# EAGLE design rcz80test_v1 (EAGLE 9.6.2)
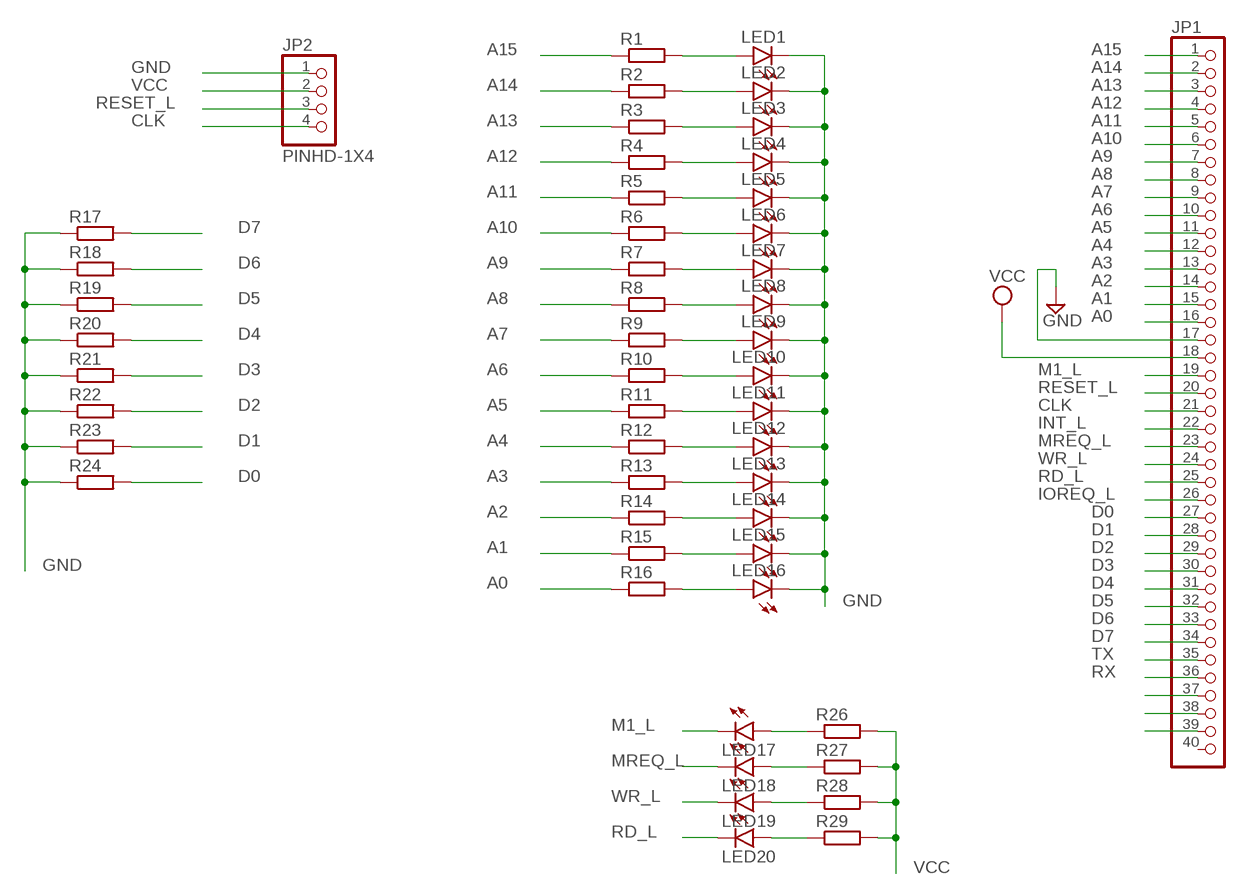
[diagram p0: schematic, sheet 1]

## Parts
JP1  PINHD-1X40  [1X40]
JP2  PINHD-1X4  [1X04]
LED1  LED3MM  [LED3MM]
LED2  LED3MM  [LED3MM]
LED3  LED3MM  [LED3MM]
LED4  LED3MM  [LED3MM]
LED5  LED3MM  [LED3MM]
LED6  LED3MM  [LED3MM]
LED7  LED3MM  [LED3MM]
LED8  LED3MM  [LED3MM]
LED9  LED3MM  [LED3MM]
LED10  LED3MM  [LED3MM]
LED11  LED3MM  [LED3MM]
LED12  LED3MM  [LED3MM]
LED13  LED3MM  [LED3MM]
LED14  LED3MM  [LED3MM]
LED15  LED3MM  [LED3MM]
LED16  LED3MM  [LED3MM]
LED17  LED3MM  [LED3MM]
LED18  LED3MM  [LED3MM]
LED19  LED3MM  [LED3MM]
LED20  LED3MM  [LED3MM]
R1  R-EU_0204/7  [0204/7]
R2  R-EU_0204/7  [0204/7]
R3  R-EU_0204/7  [0204/7]
R4  R-EU_0204/7  [0204/7]
R5  R-EU_0204/7  [0204/7]
R6  R-EU_0204/7  [0204/7]
R7  R-EU_0204/7  [0204/7]
R8  R-EU_0204/7  [0204/7]
R9  R-EU_0204/7  [0204/7]
R10  R-EU_0204/7  [0204/7]
R11  R-EU_0204/7  [0204/7]
R12  R-EU_0204/7  [0204/7]
R13  R-EU_0204/7  [0204/7]
R14  R-EU_0204/7  [0204/7]
R15  R-EU_0204/7  [0204/7]
R16  R-EU_0204/7  [0204/7]
R17  R-EU_0204/7  [0204/7]
R18  R-EU_0204/7  [0204/7]
R19  R-EU_0204/7  [0204/7]
R20  R-EU_0204/7  [0204/7]
R21  R-EU_0204/7  [0204/7]
R22  R-EU_0204/7  [0204/7]
R23  R-EU_0204/7  [0204/7]
R24  R-EU_0204/7  [0204/7]
R26  R-EU_0204/7  [0204/7]
R27  R-EU_0204/7  [0204/7]
R28  R-EU_0204/7  [0204/7]
R29  R-EU_0204/7  [0204/7]

## Nets
A0: JP1.16 R16.1
A1: JP1.15 R15.1
A2: JP1.14 R14.1
A3: JP1.13 R13.1
A4: JP1.12 R12.1
A5: JP1.11 R11.1
A6: JP1.10 R10.1
A7: JP1.9 R9.1
A8: JP1.8 R8.1
A9: JP1.7 R7.1
A10: JP1.6 R6.1
A11: JP1.5 R5.1
A12: JP1.4 R4.1
A13: JP1.3 R3.1
A14: JP1.2 R2.1
A15: JP1.1 R1.1
CLK: JP1.21 JP2.4
D0: JP1.27 R24.2
D1: JP1.28 R23.2
D2: JP1.29 R22.2
D3: JP1.30 R21.2
D4: JP1.31 R20.2
D5: JP1.32 R19.2
D6: JP1.33 R18.2
D7: JP1.34 R17.2
GND: JP1.17 JP2.1 LED1.K(C) LED2.K(C) LED3.K(C) LED4.K(C) LED5.K(C) LED6.K(C) LED7.K(C) LED8.K(C) LED9.K(C) LED10.K(C) LED11.K(C) LED12.K(C) LED13.K(C) LED14.K(C) LED15.K(C) LED16.K(C) R17.1 R18.1 R19.1 R20.1 R21.1 R22.1 R23.1 R24.1
INT_L: JP1.22
IOREQ_L: JP1.26
M1_L: JP1.19 LED17.K(C)
MREQ_L: JP1.23 LED18.K(C)
N$1: JP1.37
N$2: JP1.38
N$3: JP1.39
N$4: LED17.A R26.1
N$5: LED18.A R27.1
N$6: LED19.A R28.1
N$7: LED20.A R29.1
N$8: LED1.A R1.2
N$9: LED16.A R16.2
N$10: LED15.A R15.2
N$11: LED14.A R14.2
N$12: LED13.A R13.2
N$13: LED12.A R12.2
N$14: LED11.A R11.2
N$15: LED10.A R10.2
N$16: LED9.A R9.2
N$17: LED8.A R8.2
N$18: LED7.A R7.2
N$19: LED6.A R6.2
N$20: LED5.A R5.2
N$21: LED4.A R4.2
N$22: LED3.A R3.2
N$23: LED2.A R2.2
RD_L: JP1.25 LED20.K(C)
RESET_L: JP1.20 JP2.3
RX: JP1.36
TX: JP1.35
VCC: JP1.18 JP2.2 R26.2 R27.2 R28.2 R29.2
WR_L: JP1.24 LED19.K(C)
Unconnected: JP1.40

## Library data of the parts
JP1 = pinhead:PINHD-1X40: PIN HEADER
JP2 = Connector:PINHD-1X4: PIN HEADER; CATEGORY: CONNECTOR; SUB-CATEGORY: PIN-HEADER
LED1-LED20 = led:LED: LED OSRAM: - CHIPLED LG R971, LG N971, LY N971, LG Q971, LY Q971, LO R971, LY R971 LH N974, LH R974 LS Q976, LO Q976, LY Q976 LO Q996 - Hyper CHIPLED LW Q18S LB Q993, LB Q99A, LB R99A - SideLED LS A670, LO A670, LY A670, LG A670, LP A670 LB A673, LV A673, LT A673, LW A673 LH A674 LY A675 LS A676, LA A676, LO A676, LY A676, LW A676 LS A679, LY A679, LG A679 - Hyper Micro SIDELED® LS Y876, LA Y876, LO Y876, LY Y876 LT Y87S - SmartLED LW L88C, LW L88S LB L89C, LB L89S, LG L890 LS L89K, LO L89K, LY L89K LS L896, LA L896, LO L896, LY L896 - TOPLED LS T670, LO T670, LY T670, LG T670, LP T670 LSG T670, LSP T670, LSY T670, LOP T670, LYG T670 LG T671, LOG T671, LSG T671 LB T673, LV T673, LT T673, LW T673 LH T674 LS T676, LA T676, LO T676, LY T676, LB T676, LH T676, LSB T676, LW T676 LB T67C, LV T67C, LT T67C, LS T67K, LO T67K, LY T67K, LW E67C LS E67B, LA E67B, LO E67B, LY E67B, LB E67C, LV E67C, LT E67C LW T67C LS T679, LY T679, LG T679 LS T770, LO T770, LY T770, LG T770, LP T770 LB T773, LV T773, LT T773, LW T773 LH T774 LS E675, LA E675, LY E675, LS T675 LS T776, LA T776, LO T776, LY T776, LB T776 LHGB T686 LT T68C, LB T68C - Hyper Mini TOPLED® LB M676 - Mini TOPLED Santana® LG M470 LS M47K, LO M47K, LY M47K Source: http://www.osram.convergy.de LUXEON: - LUMILED® LXK2-PW12-R00, LXK2-PW12-S00, LXK2-PW14-U00, LXK2-PW14-V00 LXK2-PM12-R00, LXK2-PM12-S00, LXK2-PM14-U00 LXK2-PE12-Q00, LXK2-PE12-R00, LXK2-PE12-S00, LXK2-PE14-T00, LXK2-PE14-U00 LXK2-PB12-K00, LXK2-PB12-L00, LXK2-PB12-M00, LXK2-PB14-N00, LXK2-PB14-P00, LXK2-PB14-Q00 LXK2-PR12-L00, LXK2-PR12-M00, LXK2-PR14-Q00, LXK2-PR14-R00 LXK2-PD12-Q00, LXK2-PD12-R00, LXK2-PD12-S00 LXK2-PH12-R00, LXK2-PH12-S00 LXK2-PL12-P00, LXK2-PL12-Q00, LXK2-PL12-R00 Source: www.luxeon.com KINGBRIGHT: KA-3528ASYC Source: www.kingbright.com
R1-R24 R26-R29 = rcl:R-EU_: RESISTOR, European symbol; SPICEPREFIX: R

## Board
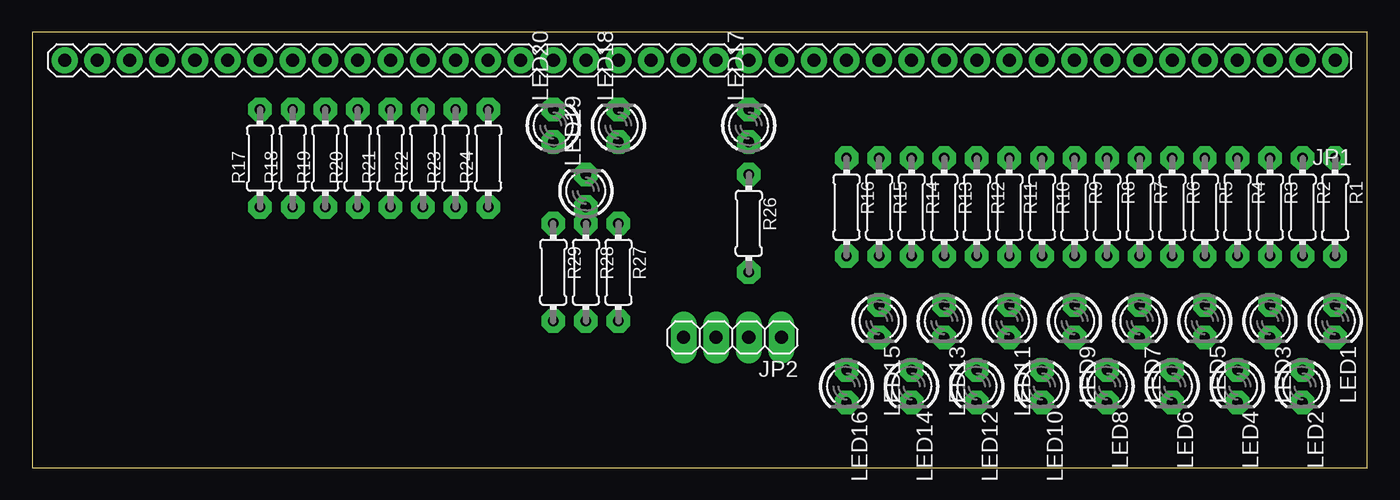
[diagram p1: board, top side]
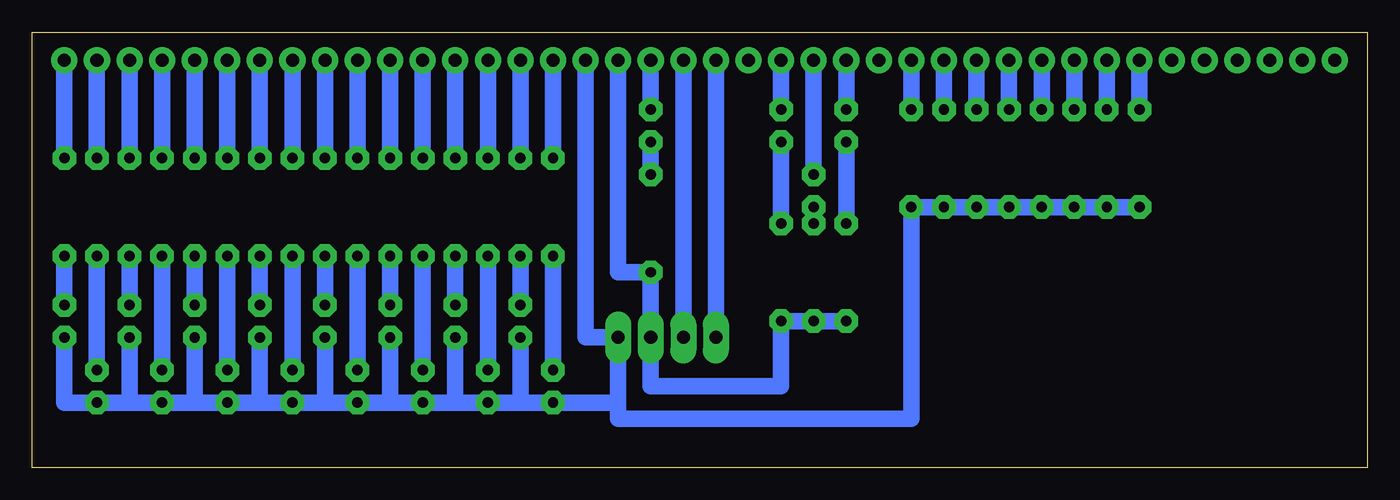
[diagram p2: board, bottom side, seen from below]

Size 104.12 x 33.96 mm. Coordinates in mm from the lower left corner, seen from the top.
Outline: 0,0 104.12,0 104.12,33.96 0,33.96 0,0
Copper layers (1*16): Top 0.035mm / dielectric 1.5mm / Bottom 0.035mm
Design rules "LabE": minimum track width 50mil, minimum drill 0.8mm, track to track 16mil, track to pad 16mil, pad to pad 16mil, via to via 16mil, smd to smd 16mil, copper to edge 0mil, drill to drill 16mil, minimum pad ring 20mil, minimum via ring 20mil, stop-mask expansion 4mil, vias tented up to drill 0mil, thermal gap 10mil

### Footprints (pad centres in the part's own frame; a part is rotated, then mirrored left to right if it is on the bottom)
1X40 = drill 1.016: 1 -49.53,0; 2 -46.99,0; 3 -44.45,0; 4 -41.91,0; 5 -39.37,0; 6 -36.83,0; 7 -34.29,0; 8 -31.75,0; 9 -29.21,0; 10 -26.67,0; 11 -24.13,0; 12 -21.59,0; 13 -19.05,0; 14 -16.51,0; 15 -13.97,0; 16 -11.43,0; 17 -8.89,0; 18 -6.35,0; 19 -3.81,0; 20 -1.27,0; 21 1.27,0; 22 3.81,0; 23 6.35,0; 24 8.89,0; 25 11.43,0; 26 13.97,0; 27 16.51,0; 28 19.05,0; 29 21.59,0; 30 24.13,0; 31 26.67,0; 32 29.21,0; 33 31.75,0; 34 34.29,0; 35 36.83,0; 36 39.37,0; 37 41.91,0; 38 44.45,0; 39 46.99,0; 40 49.53,0
1X04 = drill 1.016 long: 1 -3.81,0; 2 -1.27,0; 3 1.27,0; 4 3.81,0
LED3MM = drill 0.813 octagon: A -1.27,0; K 1.27,0
0204/7 = drill 0.813 octagon: 1 -3.81,0; 2 3.81,0

### Placement (x,y rotation side)
JP1  52.07,31.75 180 top
JP2  54.61,10.16 180 top
LED1  101.6,11.43 270 top
LED2  99.06,6.35 270 top
LED3  96.52,11.43 270 top
LED4  93.98,6.35 270 top
LED5  91.44,11.43 270 top
LED6  88.9,6.35 270 top
LED7  86.36,11.43 270 top
LED8  83.82,6.35 270 top
LED9  81.28,11.43 270 top
LED10  78.74,6.35 270 top
LED11  76.2,11.43 270 top
LED12  73.66,6.35 270 top
LED13  71.12,11.43 270 top
LED14  68.58,6.35 270 top
LED15  66.04,11.43 270 top
LED16  63.5,6.35 270 top
LED17  55.88,26.67 90 top
LED18  45.72,26.67 90 top
LED19  43.18,21.59 90 top
LED20  40.64,26.67 90 top
R1  101.6,20.32 270 top
R2  99.06,20.32 270 top
R3  96.52,20.32 270 top
R4  93.98,20.32 270 top
R5  91.44,20.32 270 top
R6  88.9,20.32 270 top
R7  86.36,20.32 270 top
R8  83.82,20.32 270 top
R9  81.28,20.32 270 top
R10  78.74,20.32 270 top
R11  76.2,20.32 270 top
R12  73.66,20.32 270 top
R13  71.12,20.32 270 top
R14  68.58,20.32 270 top
R15  66.04,20.32 270 top
R16  63.5,20.32 270 top
R17  17.78,24.13 90 top
R18  20.32,24.13 90 top
R19  22.86,24.13 90 top
R20  25.4,24.13 90 top
R21  27.94,24.13 90 top
R22  30.48,24.13 90 top
R23  33.02,24.13 90 top
R24  35.56,24.13 90 top
R26  55.88,19.05 270 top
R27  45.72,15.24 270 top
R28  43.18,15.24 270 top
R29  40.64,15.24 270 top

### Tracks (layer width: path | path; a pad name or v marks a point on that pad's centre or on a via)
A0
  Bottom 1.27: JP1.16 R16.1
A1
  Bottom 1.27: JP1.15 R15.1
A2
  Bottom 1.27: JP1.14 R14.1
A3
  Bottom 1.27: JP1.13 R13.1
A4
  Bottom 1.27: JP1.12 R12.1
A5
  Bottom 1.27: JP1.11 R11.1
A6
  Bottom 1.27: JP1.10 R10.1
A7
  Bottom 1.27: JP1.9 R9.1
A8
  Bottom 1.27: JP1.8 R8.1
A9
  Bottom 1.27: JP1.7 R7.1
A10
  Bottom 1.27: JP1.6 R6.1
A11
  Bottom 1.27: JP1.5 R5.1
A12
  Bottom 1.27: JP1.4 R4.1
A13
  Bottom 1.27: JP1.3 R3.1
A14
  Bottom 1.27: JP1.2 R2.1
A15
  Bottom 1.27: JP1.1 R1.1
CLK
  Bottom 1.27: JP1.21 JP2.4
D0
  Bottom 1.27: JP1.27 R24.2
D1
  Bottom 1.27: JP1.28 R23.2
D2
  Bottom 1.27: JP1.29 R22.2
D3
  Bottom 1.27: JP1.30 R21.2
D4
  Bottom 1.27: JP1.31 R20.2
D5
  Bottom 1.27: JP1.32 R19.2
D6
  Bottom 1.27: JP1.33 R18.2
D7
  Bottom 1.27: R17.2 JP1.34
GND
  Bottom 1.27: R17.1 R18.1 R19.1 R20.1 R21.1 R22.1 R23.1 R24.1 35.56,3.81 58.42,3.81 58.42,5.08 | 58.42,5.08 JP2.1 60.96,10.16 JP1.17 | 58.42,5.08 LED16.K 66.04,5.08 | 66.04,5.08 LED14.K 71.12,5.08 | LED1.K 101.6,5.08 LED2.K 96.52,5.08 | 96.52,5.08 LED4.K 91.44,5.08 | 91.44,5.08 LED6.K 86.36,5.08 | 86.36,5.08 LED8.K 81.28,5.08 | 81.28,5.08 LED10.K 76.2,5.08 | 76.2,5.08 LED12.K 71.12,5.08 | LED15.K 66.04,5.08 | LED13.K 71.12,5.08 | LED11.K 76.2,5.08 | LED9.K 81.28,5.08 | LED7.K 86.36,5.08 | LED5.K 91.44,5.08 | LED3.K 96.52,5.08
M1_L
  Bottom 1.27: JP1.19 LED17.K
MREQ_L
  Bottom 1.27: JP1.23 LED18.K
N$4
  Bottom 1.27: R26.1 LED17.A
N$5
  Bottom 1.27: LED18.A R27.1
N$6
  Bottom 1.27: LED19.A R28.1
N$7
  Bottom 1.27: LED20.A R29.1
N$8
  Bottom 1.27: R1.2 LED1.A
N$9
  Bottom 1.27: R16.2 LED16.A
N$10
  Bottom 1.27: R15.2 LED15.A
N$11
  Bottom 1.27: R14.2 LED14.A
N$12
  Bottom 1.27: R13.2 LED13.A
N$13
  Bottom 1.27: R12.2 LED12.A
N$14
  Bottom 1.27: R11.2 LED11.A
N$15
  Bottom 1.27: R10.2 LED10.A
N$16
  Bottom 1.27: R9.2 LED9.A
N$17
  Bottom 1.27: R8.2 LED8.A
N$18
  Bottom 1.27: R7.2 LED7.A
N$19
  Bottom 1.27: R6.2 LED6.A
N$20
  Bottom 1.27: R5.2 LED5.A
N$21
  Bottom 1.27: R4.2 LED4.A
N$22
  Bottom 1.27: R3.2 LED3.A
N$23
  Bottom 1.27: R2.2 LED2.A
RD_L
  Bottom 1.27: JP1.25 LED20.K
RESET_L
  Bottom 1.27: JP1.20 JP2.3
VCC
  Bottom 1.27: JP1.18 58.42,15.24 R26.2 JP2.2 55.88,6.35 45.72,6.35 R27.2 R28.2 R29.2
WR_L
  Bottom 1.27: JP1.24 LED19.K